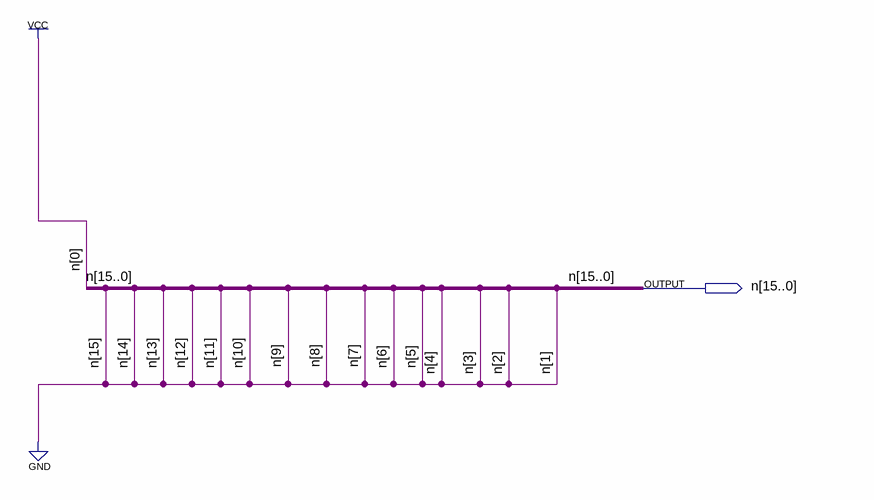
[diagram p0: schematic sheet]
// Quartus schematic in0001.bdf as structural Verilog: 0 symbols, 1 pins
module in0001 (
  output [15:0] n
);


  assign n = 16'b0000000000000001;
endmodule
